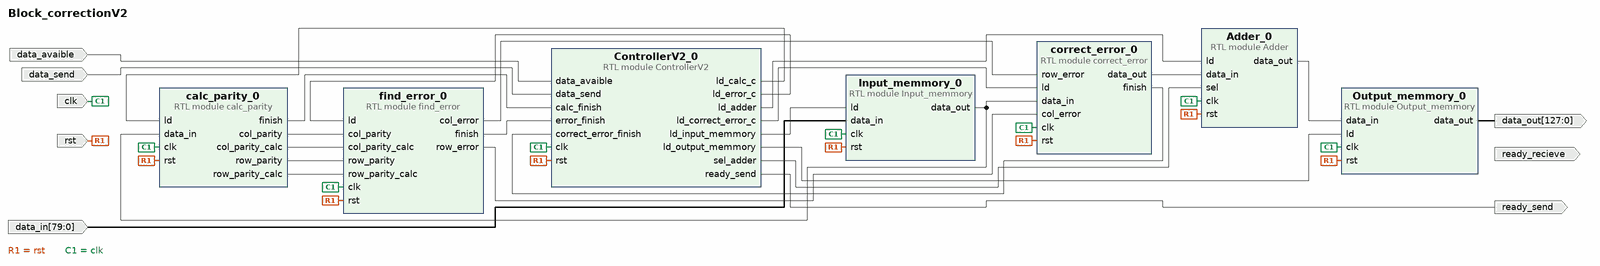
[diagram p0: block diagram of the top level]
# Vivado block design Block_correctionV2, xc7z020clg400-1, Vivado 2023.1
create_bd_design Block_correctionV2

create_bd_port -dir I clk
create_bd_port -dir I rst
create_bd_port -dir I data_avaible
create_bd_port -dir I -from 79 -to 0 data_in
create_bd_port -dir O -from 127 -to 0 data_out
create_bd_port -dir O ready_recieve
create_bd_port -dir I data_send
create_bd_port -dir O ready_send

create_bd_cell -type module -reference correct_error correct_error_0
create_bd_cell -type module -reference calc_parity calc_parity_0
create_bd_cell -type module -reference Output_memmory Output_memmory_0
create_bd_cell -type module -reference Adder Adder_0
create_bd_cell -type module -reference ControllerV2 ControllerV2_0
create_bd_cell -type module -reference Input_memmory Input_memmory_0
create_bd_cell -type module -reference find_error find_error_0

# ---- connections ----

connect_bd_net [get_bd_pins Adder_0/data_out] [get_bd_pins Output_memmory_0/data_in]
connect_bd_net [get_bd_pins ControllerV2_0/ld_adder] [get_bd_pins Adder_0/ld]
connect_bd_net [get_bd_pins ControllerV2_0/ld_calc_c] [get_bd_pins calc_parity_0/ld]
connect_bd_net [get_bd_pins ControllerV2_0/ld_correct_error_c] [get_bd_pins correct_error_0/ld]
connect_bd_net [get_bd_pins ControllerV2_0/ld_error_c] [get_bd_pins find_error_0/ld]
connect_bd_net [get_bd_pins ControllerV2_0/ld_input_memmory] [get_bd_pins Input_memmory_0/ld]
connect_bd_net [get_bd_pins ControllerV2_0/ld_output_memmory] [get_bd_pins Output_memmory_0/ld]
# net ControllerV2_0_ready has one end: ready_recieve
connect_bd_net [get_bd_pins ControllerV2_0/ready_send] [get_bd_ports ready_send]
connect_bd_net [get_bd_pins ControllerV2_0/sel_adder] [get_bd_pins Adder_0/sel]
connect_bd_net [get_bd_pins Input_memmory_0/data_out] [get_bd_pins correct_error_0/data_in] [get_bd_pins calc_parity_0/data_in]
connect_bd_net [get_bd_ports rst] \
  [get_bd_pins correct_error_0/rst] [get_bd_pins calc_parity_0/rst] [get_bd_pins Output_memmory_0/rst] \
  [get_bd_pins Adder_0/rst] [get_bd_pins ControllerV2_0/rst] [get_bd_pins Input_memmory_0/rst] [get_bd_pins find_error_0/rst]
connect_bd_net [get_bd_pins Output_memmory_0/data_out] [get_bd_ports data_out]
connect_bd_net [get_bd_pins calc_parity_0/finish] [get_bd_pins ControllerV2_0/calc_finish]
connect_bd_net [get_bd_pins calc_parity_0/col_parity] [get_bd_pins find_error_0/col_parity]
connect_bd_net [get_bd_pins calc_parity_0/col_parity_calc] [get_bd_pins find_error_0/col_parity_calc]
connect_bd_net [get_bd_pins calc_parity_0/row_parity] [get_bd_pins find_error_0/row_parity]
connect_bd_net [get_bd_pins calc_parity_0/row_parity_calc] [get_bd_pins find_error_0/row_parity_calc]
connect_bd_net [get_bd_ports clk] \
  [get_bd_pins correct_error_0/clk] [get_bd_pins calc_parity_0/clk] [get_bd_pins Output_memmory_0/clk] \
  [get_bd_pins Adder_0/clk] [get_bd_pins ControllerV2_0/clk] [get_bd_pins Input_memmory_0/clk] [get_bd_pins find_error_0/clk]
connect_bd_net [get_bd_pins correct_error_0/finish] [get_bd_pins ControllerV2_0/correct_error_finish]
connect_bd_net [get_bd_pins correct_error_0/data_out] [get_bd_pins Adder_0/data_in]
connect_bd_net [get_bd_ports data_avaible] [get_bd_pins ControllerV2_0/data_avaible]
connect_bd_net [get_bd_ports data_in] [get_bd_pins Input_memmory_0/data_in]
connect_bd_net [get_bd_ports data_send] [get_bd_pins ControllerV2_0/data_send]
connect_bd_net [get_bd_pins find_error_0/finish] [get_bd_pins ControllerV2_0/error_finish]
connect_bd_net [get_bd_pins find_error_0/col_error] [get_bd_pins correct_error_0/row_error]
connect_bd_net [get_bd_pins find_error_0/row_error] [get_bd_pins correct_error_0/col_error]

validate_bd_design
save_bd_design
